# EAGLE design SparkFun_MOSFET_PetalV0.1 (EAGLE 8.6.3)
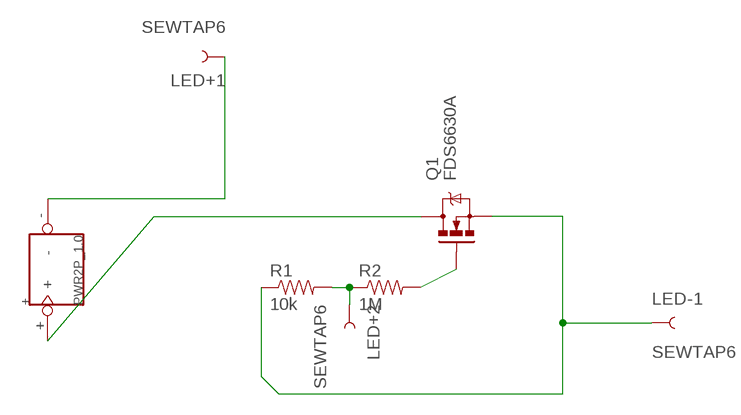
[diagram p0: schematic, sheet 1]

## Parts
+  PWR2P_1.0  [PWR2P_1.0]
LED+1  SEWTAP6  [PETAL-SMALL-2SIDE]
LED+2  SEWTAP6  [PETAL-SMALL-2SIDE]
LED-1  SEWTAP6  [PETAL-SMALL-2SIDE]
Q1  FDS6630A  MOSFET-NCHANNELFDS6630A  [SO08]
R1  10k  RESISTOR0402-RES  [0402-RES]
R2  1M  1M-1%  [0402-RES]

## Nets
GND: LED-1.1 Q1.1(S) Q1.2(S) Q1.3(S) R1.1
N$1: Q1.4(G) R2.2
N$3: +.- LED+1.1
N$4: LED+2.1 R1.2 R2.1
N$5: +.+ Q1.5(D) Q1.6(D) Q1.7(D) Q1.8(D)

## Library data of the parts
+ = Seeeduino_Film_v0.9b:PWR2P
LED+1 LED+2 LED-1 = LilyPad-Wearables:SEWTAP: Sew Taps for LilyPad Boards.
Q1 = SparkFun-DiscreteSemi:MOSFET-NCHANNEL: Common NMOSFET Parts MFG P/N Store ID Prod ID FDD8780 TRANS-09984 SI7820DN TRANS-11055 FDS6630A IC-08089 2N7002PW TRANS-11151 FQP30N06L COM-10213 TRANS-10060 BSS123LT1G TRANS-08345 BSS138 TRANS-00830 BS170 2N7000; PROD_ID: IC-08089
R1 = SparkFun-Passives:RESISTOR: Resistor Basic schematic elements and footprints for 0603, 1206, and PTH resistors.; PROD_ID: RES-00824
R2 = SparkFun-Resistors:1M-1%: 1M-ohm SMT 1/10W - 1% (0603) RES-07868; PROD_ID: RES-07868

## Board
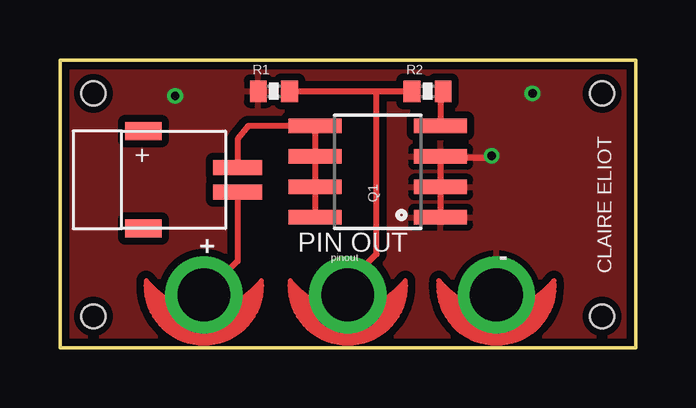
[diagram p1: board, top side]
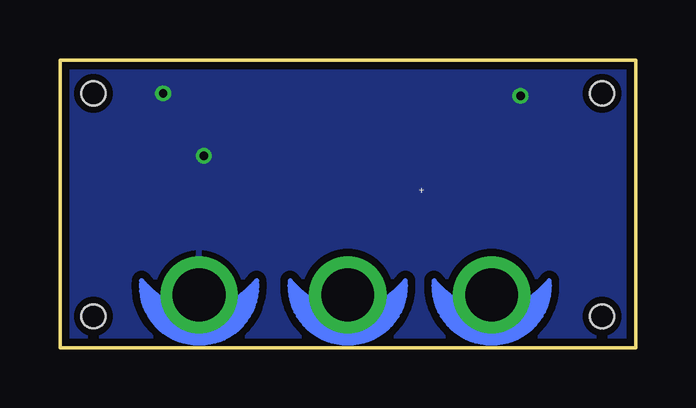
[diagram p2: board, bottom side, seen from below]

Size 24 x 12 mm. Coordinates in mm from the lower left corner, seen from the top.
Outline: 24,0 0,0 0,12 24,12 24,0
Copper layers (1*16): Top 0.035mm / dielectric 1.5mm / Bottom 0.035mm
Design rules "SeeedStudio_2layer_DRU_no_angle_20140221": minimum track width 6mil, minimum drill 12mil, track to track 6mil, track to pad 6mil, pad to pad 6mil, via to via 6mil, smd to smd 0mil, copper to edge 10mil, drill to drill 10mil, minimum pad ring 10mil, minimum via ring 6mil, stop-mask expansion 2mil, vias tented up to drill 100mil, thermal gap 10mil
Holes 1 mm at 22.6,1.3 22.6,10.6 1.4,10.6 1.4,1.3

### Footprints (pad centres in the part's own frame; a part is rotated, then mirrored left to right if it is on the bottom)
PWR2P_1.0 = smd 2.032 x 0.635: + 0.508,0.508; - 0.508,-0.508 | smd 1.524 x 0.762: P$3 -3.429,2.032; P$4 -3.429,-2.032
PETAL-SMALL-2SIDE = drill 2.2: 1 0,0
SO08 = smd 0.61 x 2.21: 1 -1.905,-2.616; 2 -0.635,-2.616; 3 0.635,-2.616; 4 1.905,-2.616; 5 1.905,2.616; 6 0.635,2.616; 7 -0.635,2.616; 8 -1.905,2.616
0402-RES = smd 0.7 x 0.9: 1 -0.65,0; 2 0.65,0

### Placement (x,y rotation side)
+  6.9,7 0 top
LED+1  6,2.2 0 top
LED+2  12,2.2 0 top
LED-1  18.2,2.2 0 top
Q1  13.25,7.34 90 top
R1  8.92,10.69 0 top
R2  15.33,10.69 0 top

### Tracks (layer width: path | path; a pad name or v marks a point on that pad's centre or on a via)
GND  (via drill 0.35)
  Top 0.254: Q1.3 15.87,7.9 | 15.87,7.9 Q1.1 | v18,8 17.9,7.9 15.87,7.9
  other vias: 4.8,10.5 19.7,10.6
  pour Top (isolate 0.305): 0.1,11.88 23.79,11.78 23.79,0 0.1,0.1
  pour Bottom (isolate 0.305): 0.1,11.98 23.89,11.88 23.89,-0.1 0.1,0
N$1
  Top 0.254: Q1.4 15.87,10.58 R2.2
N$3
  Top 0.254: +.- 7.41,3.61 LED+1.1
N$4
  Top 0.254: LED+2.1 12,2.7 13.2,3.9 13.2,10.69 | R2.1 13.2,10.69 | R1.2 13.1,10.69 13.2,10.69
N$5
  Top 0.254: +.+ 7.41,8.71 7.84,9.24 Q1.5 Q1.6 Q1.7 Q1.8

### Text on the board
tPlace: + | PIN OUT | pinout | -
bPlace: +
tNames: CLAIRE ELIOT